# EAGLE design 96LED-Board-ALU (EAGLE 9.6.2)
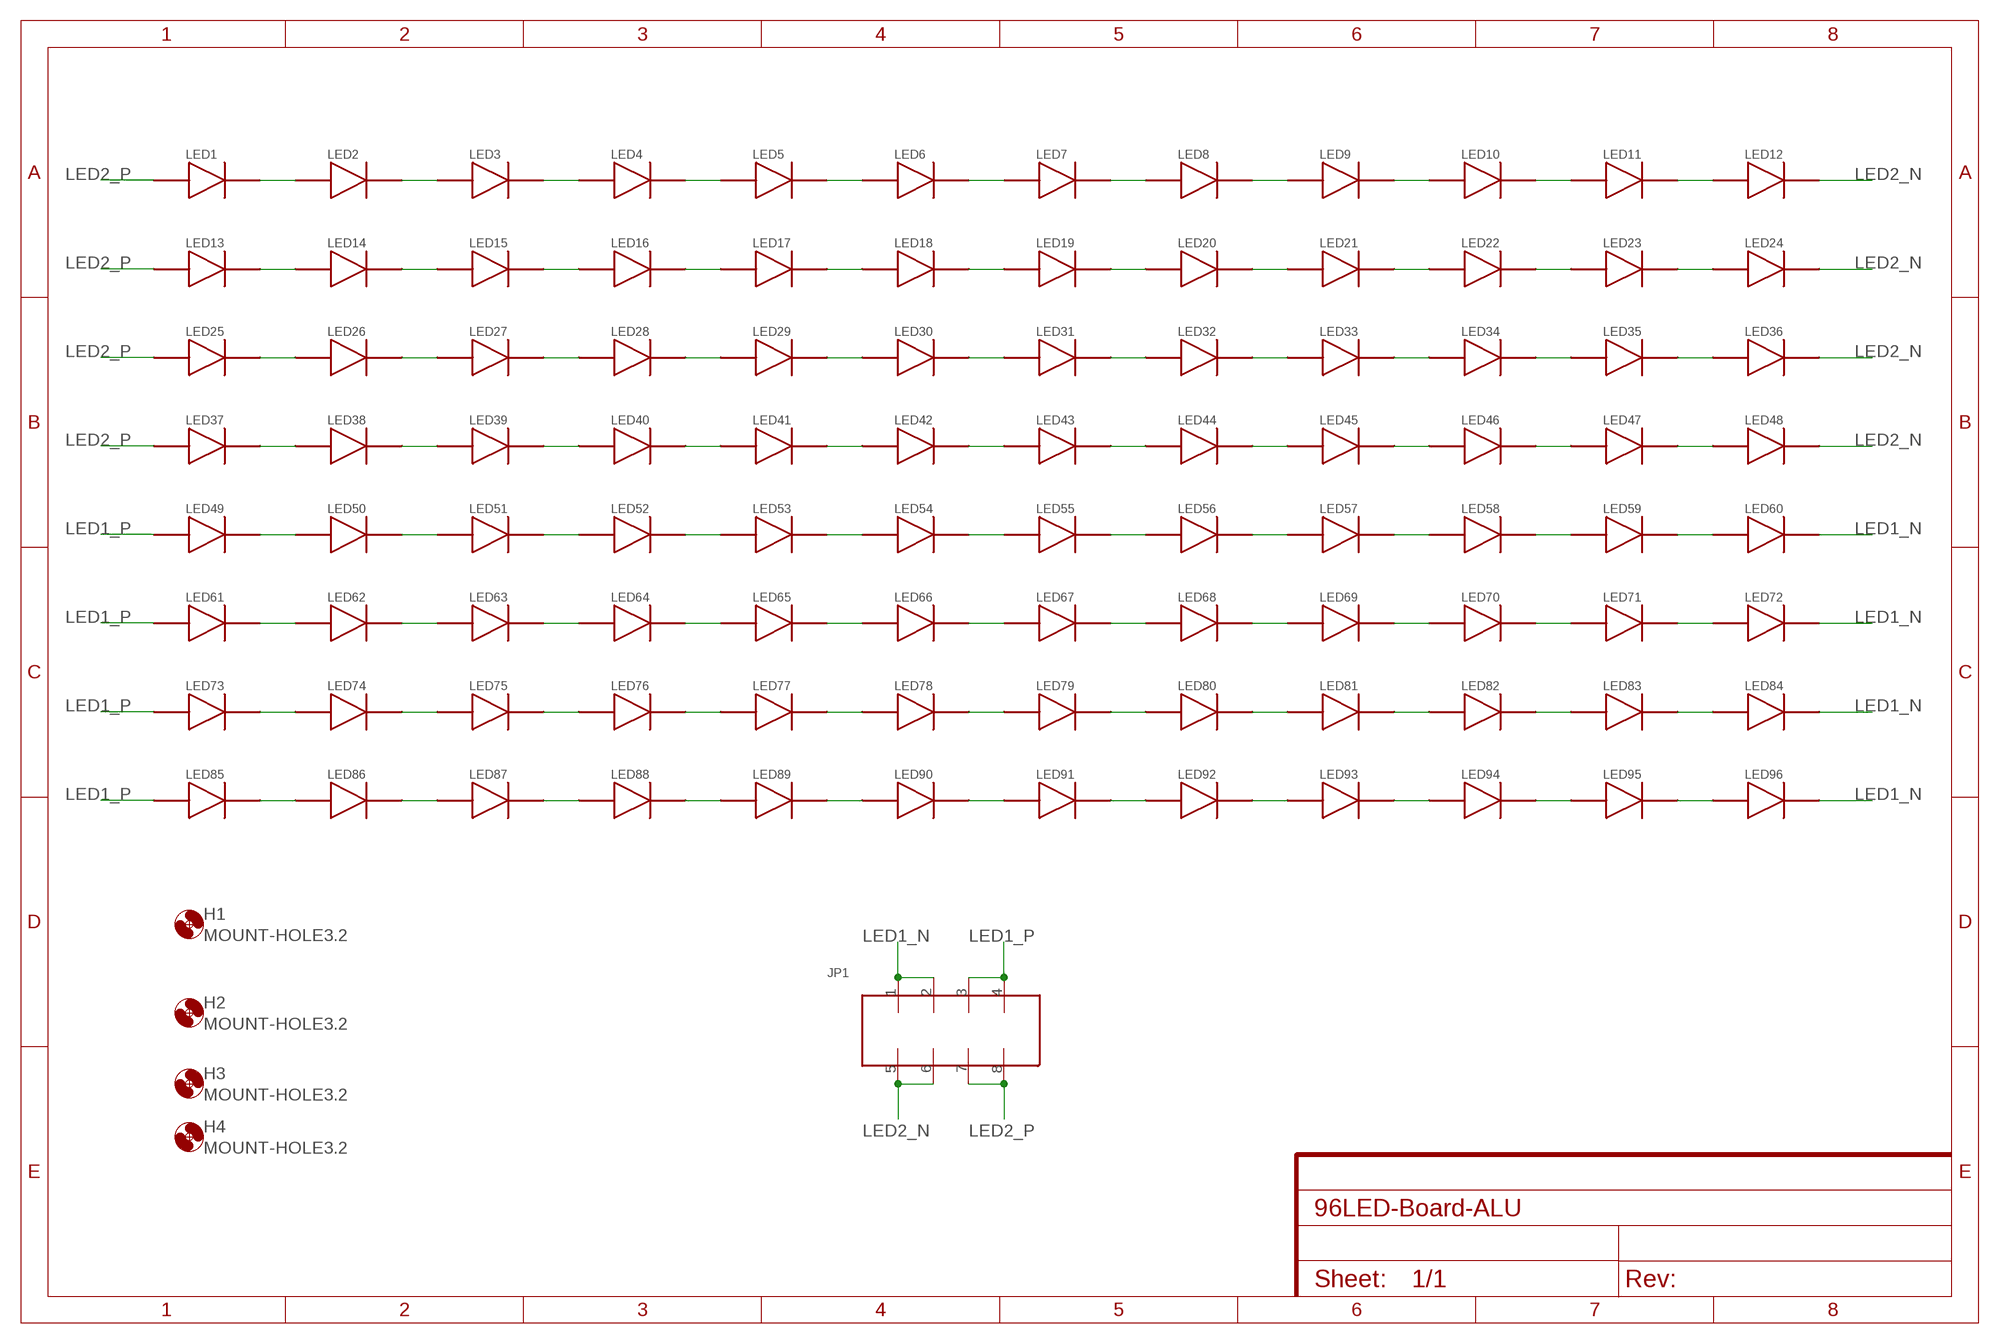
[diagram p0: schematic, sheet 1]

## Parts
H1  MOUNT-HOLE3.2  [3,2]
H2  MOUNT-HOLE3.2  [3,2]
H3  MOUNT-HOLE3.2  [3,2]
H4  MOUNT-HOLE3.2  [3,2]
JP1  2X8P_2.54_FEMALE  [2X8_PIN_SMD_2.54-FEMALE]
LED1  MP3030_N  [MP3030_N]
LED2  MP3030_N  [MP3030_N]
LED3  MP3030_N  [MP3030_N]
LED4  MP3030_N  [MP3030_N]
LED5  MP3030_N  [MP3030_N]
LED6  MP3030_N  [MP3030_N]
LED7  MP3030_N  [MP3030_N]
LED8  MP3030_N  [MP3030_N]
LED9  MP3030_N  [MP3030_N]
LED10  MP3030_N  [MP3030_N]
LED11  MP3030_N  [MP3030_N]
LED12  MP3030_N  [MP3030_N]
LED13  MP3030_N  [MP3030_N]
LED14  MP3030_N  [MP3030_N]
LED15  MP3030_N  [MP3030_N]
LED16  MP3030_N  [MP3030_N]
LED17  MP3030_N  [MP3030_N]
LED18  MP3030_N  [MP3030_N]
LED19  MP3030_N  [MP3030_N]
LED20  MP3030_N  [MP3030_N]
LED21  MP3030_N  [MP3030_N]
LED22  MP3030_N  [MP3030_N]
LED23  MP3030_N  [MP3030_N]
LED24  MP3030_N  [MP3030_N]
LED25  MP3030_N  [MP3030_N]
LED26  MP3030_N  [MP3030_N]
LED27  MP3030_N  [MP3030_N]
LED28  MP3030_N  [MP3030_N]
LED29  MP3030_N  [MP3030_N]
LED30  MP3030_N  [MP3030_N]
LED31  MP3030_N  [MP3030_N]
LED32  MP3030_N  [MP3030_N]
LED33  MP3030_N  [MP3030_N]
LED34  MP3030_N  [MP3030_N]
LED35  MP3030_N  [MP3030_N]
LED36  MP3030_N  [MP3030_N]
LED37  MP3030_N  [MP3030_N]
LED38  MP3030_N  [MP3030_N]
LED39  MP3030_N  [MP3030_N]
LED40  MP3030_N  [MP3030_N]
LED41  MP3030_N  [MP3030_N]
LED42  MP3030_N  [MP3030_N]
LED43  MP3030_N  [MP3030_N]
LED44  MP3030_N  [MP3030_N]
LED45  MP3030_N  [MP3030_N]
LED46  MP3030_N  [MP3030_N]
LED47  MP3030_N  [MP3030_N]
LED48  MP3030_N  [MP3030_N]
LED49  MP3030_N  [MP3030_N]
LED50  MP3030_N  [MP3030_N]
LED51  MP3030_N  [MP3030_N]
LED52  MP3030_N  [MP3030_N]
LED53  MP3030_N  [MP3030_N]
LED54  MP3030_N  [MP3030_N]
LED55  MP3030_N  [MP3030_N]
LED56  MP3030_N  [MP3030_N]
LED57  MP3030_N  [MP3030_N]
LED58  MP3030_N  [MP3030_N]
LED59  MP3030_N  [MP3030_N]
LED60  MP3030_N  [MP3030_N]
LED61  MP3030_N  [MP3030_N]
LED62  MP3030_N  [MP3030_N]
LED63  MP3030_N  [MP3030_N]
LED64  MP3030_N  [MP3030_N]
LED65  MP3030_N  [MP3030_N]
LED66  MP3030_N  [MP3030_N]
LED67  MP3030_N  [MP3030_N]
LED68  MP3030_N  [MP3030_N]
LED69  MP3030_N  [MP3030_N]
LED70  MP3030_N  [MP3030_N]
LED71  MP3030_N  [MP3030_N]
LED72  MP3030_N  [MP3030_N]
LED73  MP3030_N  [MP3030_N]
LED74  MP3030_N  [MP3030_N]
LED75  MP3030_N  [MP3030_N]
LED76  MP3030_N  [MP3030_N]
LED77  MP3030_N  [MP3030_N]
LED78  MP3030_N  [MP3030_N]
LED79  MP3030_N  [MP3030_N]
LED80  MP3030_N  [MP3030_N]
LED81  MP3030_N  [MP3030_N]
LED82  MP3030_N  [MP3030_N]
LED83  MP3030_N  [MP3030_N]
LED84  MP3030_N  [MP3030_N]
LED85  MP3030_N  [MP3030_N]
LED86  MP3030_N  [MP3030_N]
LED87  MP3030_N  [MP3030_N]
LED88  MP3030_N  [MP3030_N]
LED89  MP3030_N  [MP3030_N]
LED90  MP3030_N  [MP3030_N]
LED91  MP3030_N  [MP3030_N]
LED92  MP3030_N  [MP3030_N]
LED93  MP3030_N  [MP3030_N]
LED94  MP3030_N  [MP3030_N]
LED95  MP3030_N  [MP3030_N]
LED96  MP3030_N  [MP3030_N]

## Nets
LED1_N: JP1.1 JP1.2 LED60.2 LED72.2 LED84.2 LED96.2
LED1_P: JP1.3 JP1.4 LED49.1 LED61.1 LED73.1 LED85.1
LED2_N: JP1.5 JP1.6 LED12.2 LED24.2 LED36.2 LED48.2
LED2_P: JP1.7 JP1.8 LED1.1 LED13.1 LED25.1 LED37.1
N$2: LED1.2 LED2.1
N$3: LED2.2 LED3.1
N$4: LED3.2 LED4.1
N$5: LED4.2 LED5.1
N$6: LED5.2 LED6.1
N$7: LED6.2 LED7.1
N$8: LED7.2 LED8.1
N$9: LED8.2 LED9.1
N$10: LED9.2 LED10.1
N$11: LED10.2 LED11.1
N$12: LED11.2 LED12.1
N$15: LED13.2 LED14.1
N$16: LED14.2 LED15.1
N$17: LED15.2 LED16.1
N$18: LED16.2 LED17.1
N$19: LED17.2 LED18.1
N$20: LED18.2 LED19.1
N$21: LED19.2 LED20.1
N$22: LED20.2 LED21.1
N$23: LED21.2 LED22.1
N$24: LED22.2 LED23.1
N$25: LED23.2 LED24.1
N$28: LED25.2 LED26.1
N$29: LED26.2 LED27.1
N$30: LED27.2 LED28.1
N$31: LED28.2 LED29.1
N$32: LED29.2 LED30.1
N$33: LED30.2 LED31.1
N$34: LED31.2 LED32.1
N$35: LED32.2 LED33.1
N$36: LED33.2 LED34.1
N$37: LED34.2 LED35.1
N$38: LED35.2 LED36.1
N$41: LED37.2 LED38.1
N$42: LED38.2 LED39.1
N$43: LED39.2 LED40.1
N$44: LED40.2 LED41.1
N$45: LED41.2 LED42.1
N$46: LED42.2 LED43.1
N$47: LED43.2 LED44.1
N$48: LED44.2 LED45.1
N$49: LED45.2 LED46.1
N$50: LED46.2 LED47.1
N$51: LED47.2 LED48.1
N$54: LED49.2 LED50.1
N$55: LED50.2 LED51.1
N$56: LED51.2 LED52.1
N$57: LED52.2 LED53.1
N$58: LED53.2 LED54.1
N$59: LED54.2 LED55.1
N$60: LED55.2 LED56.1
N$61: LED56.2 LED57.1
N$62: LED57.2 LED58.1
N$63: LED58.2 LED59.1
N$64: LED59.2 LED60.1
N$67: LED61.2 LED62.1
N$68: LED62.2 LED63.1
N$69: LED63.2 LED64.1
N$70: LED64.2 LED65.1
N$71: LED65.2 LED66.1
N$72: LED66.2 LED67.1
N$73: LED67.2 LED68.1
N$74: LED68.2 LED69.1
N$75: LED69.2 LED70.1
N$76: LED70.2 LED71.1
N$77: LED71.2 LED72.1
N$80: LED73.2 LED74.1
N$81: LED74.2 LED75.1
N$82: LED75.2 LED76.1
N$83: LED76.2 LED77.1
N$84: LED77.2 LED78.1
N$85: LED78.2 LED79.1
N$86: LED79.2 LED80.1
N$87: LED80.2 LED81.1
N$88: LED81.2 LED82.1
N$89: LED82.2 LED83.1
N$90: LED83.2 LED84.1
N$93: LED85.2 LED86.1
N$94: LED86.2 LED87.1
N$95: LED87.2 LED88.1
N$96: LED88.2 LED89.1
N$97: LED89.2 LED90.1
N$98: LED90.2 LED91.1
N$99: LED91.2 LED92.1
N$100: LED92.2 LED93.1
N$101: LED93.2 LED94.1
N$102: LED94.2 LED95.1
N$103: LED95.2 LED96.1

## Library data of the parts
H1-H4 = holes:MOUNT-HOLE: MOUNTING HOLE with drill center marker
JP1 = MP3030:2X8P_2.54_FEMALE
LED1-LED96 = MP3030:MP3030_N: MP3030 Mid Power LED

## Board
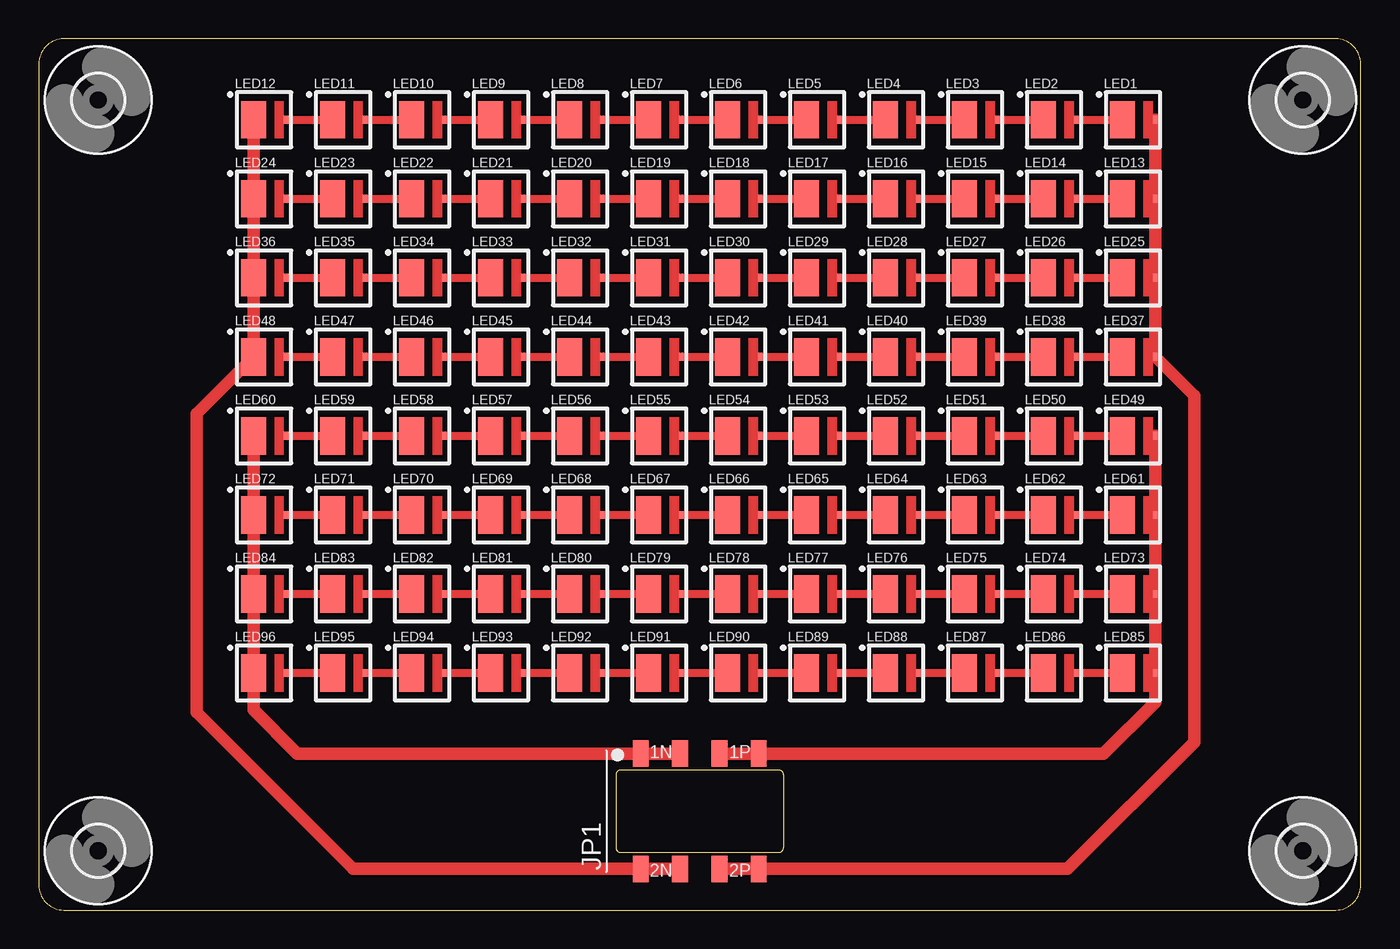
[diagram p1: board, top side]

Size 85 x 56 mm. Coordinates in mm from the lower left corner, seen from the top.
Outline: 0,54.4 0,1.6 arc90 1.6,0 83.4,0 arc90 85,1.6 85,54.4 arc90 83.4,56 1.6,56 arc90 0,54.4
Copper layers (1*16): Top 0.035mm / dielectric 1.5mm / Bottom 0.035mm
Design rules "default": minimum track width 6mil, minimum drill 0.35mm, track to track 6mil, track to pad 6mil, pad to pad 6mil, via to via 6mil, smd to smd 6mil, copper to edge 40mil, drill to drill 6mil, minimum pad ring 10mil, minimum via ring 8mil, stop-mask expansion 4mil, vias tented up to drill 0mil, thermal gap 10mil

### Footprints (pad centres in the part's own frame; a part is rotated, then mirrored left to right if it is on the bottom)
3,2 = hole 3.2: 0,0
2X8_PIN_SMD_2.54-FEMALE = smd 1.02 x 1.7: 1 -3.79,3.7; 2 -1.27,3.7; 3 1.27,3.7; 4 3.79,3.7; 5 -3.79,-3.7; 6 -1.27,-3.7; 7 1.27,-3.7; 8 3.79,-3.7
MP3030_N = smd 0.3 x 0.5: 1 1.3,0 | smd 1.6 x 2.4: 2 -0.8,0

### Placement (x,y rotation side)
H1  3.81,52.07 0 top
H2  3.81,3.81 0 top
H3  81.28,3.81 0 top
H4  81.28,52.07 0 top
JP1  42.5,6.35 0 top
LED1  70.48,50.8 0 top
LED2  65.41,50.8 0 top
LED3  60.33,50.8 0 top
LED4  55.24,50.8 0 top
LED5  50.16,50.8 0 top
LED6  45.09,50.8 0 top
LED7  40.01,50.8 0 top
LED8  34.92,50.8 0 top
LED9  29.84,50.8 0 top
LED10  24.77,50.8 0 top
LED11  19.68,50.8 0 top
LED12  14.61,50.8 0 top
LED13  70.48,45.72 0 top
LED14  65.41,45.72 0 top
LED15  60.33,45.72 0 top
LED16  55.24,45.72 0 top
LED17  50.16,45.72 0 top
LED18  45.09,45.72 0 top
LED19  40.01,45.72 0 top
LED20  34.92,45.72 0 top
LED21  29.84,45.72 0 top
LED22  24.77,45.72 0 top
LED23  19.68,45.72 0 top
LED24  14.61,45.72 0 top
LED25  70.48,40.64 0 top
LED26  65.41,40.64 0 top
LED27  60.33,40.64 0 top
LED28  55.24,40.64 0 top
LED29  50.16,40.64 0 top
LED30  45.09,40.64 0 top
LED31  40.01,40.64 0 top
LED32  34.92,40.64 0 top
LED33  29.84,40.64 0 top
LED34  24.77,40.64 0 top
LED35  19.68,40.64 0 top
LED36  14.61,40.64 0 top
LED37  70.48,35.56 0 top
LED38  65.41,35.56 0 top
LED39  60.33,35.56 0 top
LED40  55.24,35.56 0 top
LED41  50.16,35.56 0 top
LED42  45.09,35.56 0 top
LED43  40.01,35.56 0 top
LED44  34.92,35.56 0 top
LED45  29.84,35.56 0 top
LED46  24.77,35.56 0 top
LED47  19.68,35.56 0 top
LED48  14.61,35.56 0 top
LED49  70.48,30.48 0 top
LED50  65.41,30.48 0 top
LED51  60.33,30.48 0 top
LED52  55.24,30.48 0 top
LED53  50.16,30.48 0 top
LED54  45.09,30.48 0 top
LED55  40.01,30.48 0 top
LED56  34.92,30.48 0 top
LED57  29.84,30.48 0 top
LED58  24.77,30.48 0 top
LED59  19.68,30.48 0 top
LED60  14.61,30.48 0 top
LED61  70.48,25.4 0 top
LED62  65.41,25.4 0 top
LED63  60.33,25.4 0 top
LED64  55.24,25.4 0 top
LED65  50.16,25.4 0 top
LED66  45.09,25.4 0 top
LED67  40.01,25.4 0 top
LED68  34.92,25.4 0 top
LED69  29.84,25.4 0 top
LED70  24.77,25.4 0 top
LED71  19.68,25.4 0 top
LED72  14.61,25.4 0 top
LED73  70.48,20.32 0 top
LED74  65.41,20.32 0 top
LED75  60.33,20.32 0 top
LED76  55.24,20.32 0 top
LED77  50.16,20.32 0 top
LED78  45.09,20.32 0 top
LED79  40.01,20.32 0 top
LED80  34.92,20.32 0 top
LED81  29.84,20.32 0 top
LED82  24.77,20.32 0 top
LED83  19.68,20.32 0 top
LED84  14.61,20.32 0 top
LED85  70.48,15.24 0 top
LED86  65.41,15.24 0 top
LED87  60.33,15.24 0 top
LED88  55.24,15.24 0 top
LED89  50.16,15.24 0 top
LED90  45.09,15.24 0 top
LED91  40.01,15.24 0 top
LED92  34.92,15.24 0 top
LED93  29.84,15.24 0 top
LED94  24.77,15.24 0 top
LED95  19.68,15.24 0 top
LED96  14.61,15.24 0 top

### Tracks (layer width: path | path; a pad name or v marks a point on that pad's centre or on a via)
LED1_N
  Top 0.813: LED60.2 LED72.2 LED84.2 LED96.2 13.8,12.87 16.62,10.05 JP1.1 JP1.2
LED1_P
  Top 0.813: JP1.3 JP1.4 68.47,10.05 71.78,13.37 LED85.1 LED73.1 LED61.1 LED49.1
LED2_N
  Top 0.813: LED12.2 LED24.2 LED36.2 LED48.2 10.16,31.91 10.16,12.7 20.21,2.65 JP1.5 JP1.6
LED2_P
  Top 0.813: JP1.7 JP1.8 64.14,2.65 66.15,2.65 74.3,10.79 74.3,33.05 LED37.1 LED25.1 LED13.1 LED1.1
N$2
  Top 0.508: LED2.1 LED1.2
N$3
  Top 0.508: LED3.1 LED2.2
N$4
  Top 0.508: LED4.1 LED3.2
N$5
  Top 0.508: LED5.1 LED4.2
N$6
  Top 0.508: LED6.1 LED5.2
N$7
  Top 0.508: LED7.1 LED6.2
N$8
  Top 0.508: LED8.1 LED7.2
N$9
  Top 0.508: LED9.1 LED8.2
N$10
  Top 0.508: LED10.1 LED9.2
N$11
  Top 0.508: LED11.1 LED10.2
N$12
  Top 0.508: LED12.1 LED11.2
N$15
  Top 0.508: LED14.1 LED13.2
N$16
  Top 0.508: LED15.1 LED14.2
N$17
  Top 0.508: LED16.1 LED15.2
N$18
  Top 0.508: LED17.1 LED16.2
N$19
  Top 0.508: LED18.1 LED17.2
N$20
  Top 0.508: LED19.1 LED18.2
N$21
  Top 0.508: LED20.1 LED19.2
N$22
  Top 0.508: LED21.1 LED20.2
N$23
  Top 0.508: LED22.1 LED21.2
N$24
  Top 0.508: LED23.1 LED22.2
N$25
  Top 0.508: LED24.1 LED23.2
N$28
  Top 0.508: LED26.1 LED25.2
N$29
  Top 0.508: LED27.1 LED26.2
N$30
  Top 0.508: LED28.1 LED27.2
N$31
  Top 0.508: LED29.1 LED28.2
N$32
  Top 0.508: LED30.1 LED29.2
N$33
  Top 0.508: LED31.1 LED30.2
N$34
  Top 0.508: LED32.1 LED31.2
N$35
  Top 0.508: LED33.1 LED32.2
N$36
  Top 0.508: LED34.1 LED33.2
N$37
  Top 0.508: LED35.1 LED34.2
N$38
  Top 0.508: LED36.1 LED35.2
N$41
  Top 0.508: LED38.1 LED37.2
N$42
  Top 0.508: LED39.1 LED38.2
N$43
  Top 0.508: LED40.1 LED39.2
N$44
  Top 0.508: LED41.1 LED40.2
N$45
  Top 0.508: LED42.1 LED41.2
N$46
  Top 0.508: LED43.1 LED42.2
N$47
  Top 0.508: LED44.1 LED43.2
N$48
  Top 0.508: LED45.1 LED44.2
N$49
  Top 0.508: LED46.1 LED45.2
N$50
  Top 0.508: LED47.1 LED46.2
N$51
  Top 0.508: LED48.1 LED47.2
N$54
  Top 0.508: LED50.1 LED49.2
N$55
  Top 0.508: LED51.1 LED50.2
N$56
  Top 0.508: LED52.1 LED51.2
N$57
  Top 0.508: LED53.1 LED52.2
N$58
  Top 0.508: LED54.1 LED53.2
N$59
  Top 0.508: LED55.1 LED54.2
N$60
  Top 0.508: LED56.1 LED55.2
N$61
  Top 0.508: LED57.1 LED56.2
N$62
  Top 0.508: LED58.1 LED57.2
N$63
  Top 0.508: LED59.1 LED58.2
N$64
  Top 0.508: LED60.1 LED59.2
N$67
  Top 0.508: LED62.1 LED61.2
N$68
  Top 0.508: LED63.1 LED62.2
N$69
  Top 0.508: LED64.1 LED63.2
N$70
  Top 0.508: LED65.1 LED64.2
N$71
  Top 0.508: LED66.1 LED65.2
N$72
  Top 0.508: LED67.1 LED66.2
N$73
  Top 0.508: LED68.1 LED67.2
N$74
  Top 0.508: LED69.1 LED68.2
N$75
  Top 0.508: LED70.1 LED69.2
N$76
  Top 0.508: LED71.1 LED70.2
N$77
  Top 0.508: LED72.1 LED71.2
N$80
  Top 0.508: LED74.1 LED73.2
N$81
  Top 0.508: LED75.1 LED74.2
N$82
  Top 0.508: LED76.1 LED75.2
N$83
  Top 0.508: LED77.1 LED76.2
N$84
  Top 0.508: LED78.1 LED77.2
N$85
  Top 0.508: LED79.1 LED78.2
N$86
  Top 0.508: LED80.1 LED79.2
N$87
  Top 0.508: LED81.1 LED80.2
N$88
  Top 0.508: LED82.1 LED81.2
N$89
  Top 0.508: LED83.1 LED82.2
N$90
  Top 0.508: LED84.1 LED83.2
N$93
  Top 0.508: LED86.1 LED85.2
N$94
  Top 0.508: LED87.1 LED86.2
N$95
  Top 0.508: LED88.1 LED87.2
N$96
  Top 0.508: LED89.1 LED88.2
N$97
  Top 0.508: LED90.1 LED89.2
N$98
  Top 0.508: LED91.1 LED90.2
N$99
  Top 0.508: LED92.1 LED91.2
N$100
  Top 0.508: LED93.1 LED92.2
N$101
  Top 0.508: LED94.1 LED93.2
N$102
  Top 0.508: LED95.1 LED94.2
N$103
  Top 0.508: LED96.1 LED95.2

### Text on the board
tNames: 1N | 1P | 2N | 2P